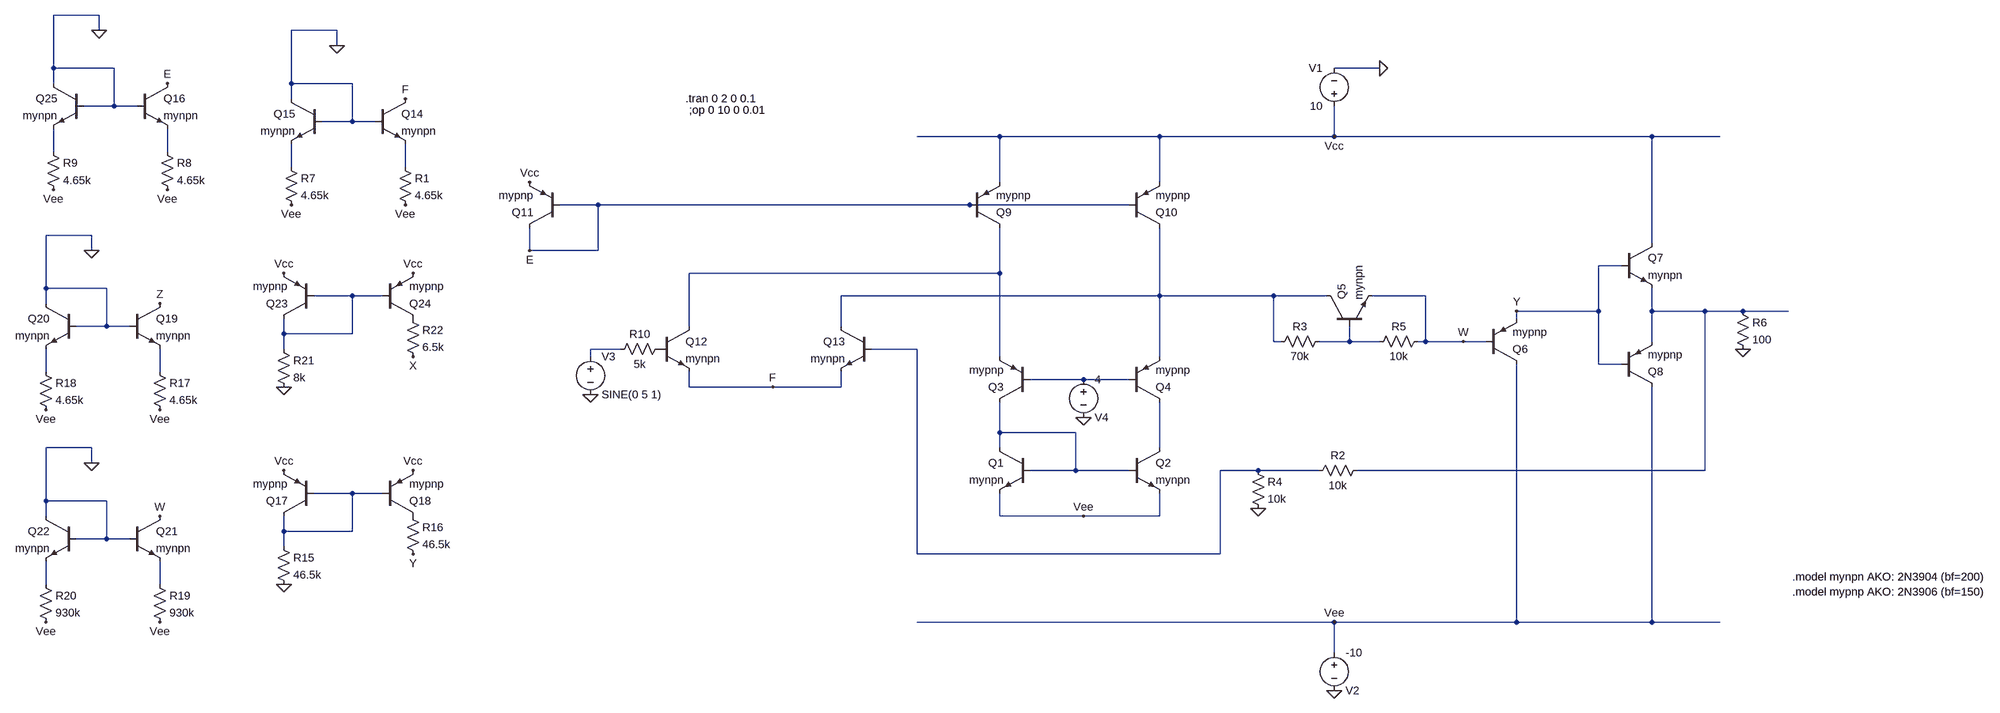
[diagram p0: schematic Draft1.asc]
Draft1.asc, the LTspice schematic file:
Version 4
SHEET 1 2324 680
WIRE -2576 -880 -2672 -880
WIRE -2576 -848 -2576 -880
WIRE -2000 -848 -2096 -848
WIRE -2000 -816 -2000 -848
WIRE -2672 -768 -2672 -880
WIRE -2544 -768 -2672 -768
WIRE 816 -768 720 -768
WIRE -2672 -736 -2672 -768
WIRE -2096 -736 -2096 -848
WIRE -1968 -736 -2096 -736
WIRE -2096 -704 -2096 -736
WIRE -2544 -688 -2544 -768
WIRE -2544 -688 -2608 -688
WIRE -2496 -688 -2544 -688
WIRE -1968 -656 -1968 -736
WIRE -1968 -656 -2032 -656
WIRE -1920 -656 -1968 -656
WIRE 16 -624 -160 -624
WIRE 352 -624 16 -624
WIRE 720 -624 720 -688
WIRE 720 -624 352 -624
WIRE 1392 -624 720 -624
WIRE 1536 -624 1392 -624
WIRE -2672 -592 -2672 -640
WIRE -2432 -592 -2432 -640
WIRE -2096 -560 -2096 -608
WIRE -1856 -560 -1856 -608
WIRE 16 -528 16 -624
WIRE 352 -528 352 -624
WIRE -832 -480 -912 -480
WIRE -48 -480 -832 -480
WIRE 288 -480 -48 -480
WIRE -2592 -416 -2688 -416
WIRE 1392 -400 1392 -624
WIRE -2592 -384 -2592 -416
WIRE -976 -384 -976 -432
WIRE -832 -384 -832 -480
WIRE -832 -384 -976 -384
WIRE 1328 -352 1280 -352
WIRE 16 -336 16 -432
WIRE 16 -336 -640 -336
WIRE -2688 -304 -2688 -416
WIRE -2560 -304 -2688 -304
WIRE -1968 -288 -2048 -288
WIRE -1904 -288 -1968 -288
WIRE 352 -288 352 -432
WIRE 352 -288 -320 -288
WIRE 592 -288 352 -288
WIRE 704 -288 592 -288
WIRE 912 -288 800 -288
WIRE -2688 -272 -2688 -304
WIRE 1280 -256 1280 -352
WIRE 1280 -256 1104 -256
WIRE 1392 -256 1392 -304
WIRE 1504 -256 1392 -256
WIRE 1584 -256 1504 -256
WIRE 1680 -256 1584 -256
WIRE 1104 -240 1104 -256
WIRE -2560 -224 -2560 -304
WIRE -2560 -224 -2624 -224
WIRE -2512 -224 -2560 -224
WIRE -640 -224 -640 -336
WIRE -320 -224 -320 -288
WIRE -2112 -208 -2112 -240
WIRE -1968 -208 -1968 -288
WIRE -1968 -208 -2112 -208
WIRE 592 -192 592 -288
WIRE 608 -192 592 -192
WIRE 752 -192 752 -224
WIRE 752 -192 688 -192
WIRE 816 -192 752 -192
WIRE 912 -192 912 -288
WIRE 912 -192 896 -192
WIRE 992 -192 912 -192
WIRE 1040 -192 992 -192
WIRE 1392 -192 1392 -256
WIRE -2112 -176 -2112 -208
WIRE -784 -176 -848 -176
WIRE -160 -176 -256 -176
WIRE -848 -160 -848 -176
WIRE 16 -160 16 -336
WIRE 352 -160 352 -288
WIRE 1280 -144 1280 -256
WIRE 1328 -144 1280 -144
WIRE -2688 -128 -2688 -176
WIRE -2448 -128 -2448 -176
WIRE 192 -112 80 -112
WIRE 288 -112 192 -112
WIRE -640 -96 -640 -128
WIRE -464 -96 -640 -96
WIRE -320 -96 -320 -128
WIRE -320 -96 -464 -96
WIRE 16 0 16 -64
WIRE 176 0 16 0
WIRE -2592 32 -2688 32
WIRE 16 32 16 0
WIRE 352 32 352 -64
WIRE -2592 64 -2592 32
WIRE 176 80 176 0
WIRE 176 80 80 80
WIRE 288 80 176 80
WIRE 560 80 480 80
WIRE 688 80 560 80
WIRE 1504 80 1504 -256
WIRE 1504 80 768 80
WIRE -1968 128 -2048 128
WIRE -1904 128 -1968 128
WIRE -2688 144 -2688 32
WIRE -2560 144 -2688 144
WIRE -2688 176 -2688 144
WIRE 16 176 16 128
WIRE 192 176 16 176
WIRE 352 176 352 128
WIRE 352 176 192 176
WIRE -2112 208 -2112 176
WIRE -1968 208 -1968 128
WIRE -1968 208 -2112 208
WIRE -2560 224 -2560 144
WIRE -2560 224 -2624 224
WIRE -2512 224 -2560 224
WIRE -2112 240 -2112 208
WIRE -160 256 -160 -176
WIRE 480 256 480 80
WIRE 480 256 -160 256
WIRE -2688 320 -2688 272
WIRE -2448 320 -2448 272
WIRE 720 400 -160 400
WIRE 1104 400 1104 -144
WIRE 1104 400 720 400
WIRE 1392 400 1392 -96
WIRE 1392 400 1104 400
WIRE 1536 400 1392 400
WIRE 720 464 720 400
FLAG 1584 -176 0
FLAG 560 160 0
FLAG 720 544 0
FLAG 816 -768 0
FLAG 720 -624 Vcc
FLAG 720 400 Vee
FLAG 1104 -256 Y
FLAG 992 -192 W
FLAG -1840 80 Vcc
FLAG -2112 80 Vcc
FLAG -2112 320 0
FLAG -1840 256 Y
FLAG -2592 -384 0
FLAG -2688 -48 Vee
FLAG -2448 -272 Z
FLAG -2448 -48 Vee
FLAG -2592 64 0
FLAG -2688 400 Vee
FLAG -2448 400 Vee
FLAG -2448 176 W
FLAG -1840 -336 Vcc
FLAG -2112 -336 Vcc
FLAG -2112 -96 0
FLAG -1840 -160 X
FLAG 192 -32 0
FLAG -976 -528 Vcc
FLAG 192 176 Vee
FLAG -2000 -816 0
FLAG -2096 -480 Vee
FLAG -1856 -480 Vee
FLAG -1856 -704 F
FLAG -464 -96 F
FLAG -2576 -848 0
FLAG -2672 -512 Vee
FLAG -2432 -512 Vee
FLAG -2432 -736 E
FLAG -976 -384 E
FLAG -848 -80 0
SYMBOL npn 80 32 M0
SYMATTR InstName Q1
SYMATTR Value mynpn
SYMBOL npn 288 32 R0
SYMATTR InstName Q2
SYMATTR Value mynpn
SYMBOL npn 704 -224 R270
SYMATTR InstName Q5
SYMATTR Value mynpn
SYMBOL npn 1328 -400 R0
SYMATTR InstName Q7
SYMATTR Value mynpn
SYMBOL pnp 1040 -144 M180
SYMATTR InstName Q6
SYMATTR Value mypnp
SYMBOL pnp 1328 -96 M180
SYMATTR InstName Q8
SYMATTR Value mypnp
SYMBOL voltage 720 -672 R180
WINDOW 0 24 96 Left 2
WINDOW 3 24 16 Left 2
WINDOW 123 0 0 Left 0
WINDOW 39 0 0 Left 0
SYMATTR InstName V1
SYMATTR Value 10
SYMBOL voltage 720 448 R0
WINDOW 0 24 96 Left 2
WINDOW 3 24 16 Left 2
WINDOW 123 0 0 Left 0
WINDOW 39 0 0 Left 0
SYMATTR InstName V2
SYMATTR Value -10
SYMBOL res 784 64 R90
WINDOW 0 0 56 VBottom 2
WINDOW 3 32 56 VTop 2
SYMATTR InstName R2
SYMATTR Value 10k
SYMBOL res 704 -208 R90
WINDOW 0 0 56 VBottom 2
WINDOW 3 32 56 VTop 2
SYMATTR InstName R3
SYMATTR Value 70k
SYMBOL res 544 64 R0
SYMATTR InstName R4
SYMATTR Value 10k
SYMBOL res 912 -208 R90
WINDOW 0 0 56 VBottom 2
WINDOW 3 32 56 VTop 2
SYMATTR InstName R5
SYMATTR Value 10k
SYMBOL res 1568 -272 R0
SYMATTR InstName R6
SYMATTR Value 100
SYMBOL voltage 192 -128 R0
WINDOW 0 24 96 Left 2
WINDOW 3 24 16 Left 2
WINDOW 123 0 0 Left 0
WINDOW 39 0 0 Left 0
SYMATTR InstName V4
SYMATTR Value 4
SYMBOL pnp -2048 176 R180
SYMATTR InstName Q17
SYMATTR Value mypnp
SYMBOL pnp -1904 176 M180
SYMATTR InstName Q18
SYMATTR Value mypnp
SYMBOL res -2128 224 R0
SYMATTR InstName R15
SYMATTR Value 46.5k
SYMBOL res -1856 160 R0
SYMATTR InstName R16
SYMATTR Value 46.5k
SYMBOL npn -2512 -272 R0
SYMATTR InstName Q19
SYMATTR Value mynpn
SYMBOL npn -2624 -272 M0
SYMATTR InstName Q20
SYMATTR Value mynpn
SYMBOL res -2464 -144 R0
SYMATTR InstName R17
SYMATTR Value 4.65k
SYMBOL res -2704 -144 R0
SYMATTR InstName R18
SYMATTR Value 4.65k
SYMBOL npn -2512 176 R0
SYMATTR InstName Q21
SYMATTR Value mynpn
SYMBOL npn -2624 176 M0
SYMATTR InstName Q22
SYMATTR Value mynpn
SYMBOL res -2464 304 R0
SYMATTR InstName R19
SYMATTR Value 930k
SYMBOL res -2704 304 R0
SYMATTR InstName R20
SYMATTR Value 930k
SYMBOL pnp -2048 -240 R180
SYMATTR InstName Q23
SYMATTR Value mypnp
SYMBOL pnp -1904 -240 M180
SYMATTR InstName Q24
SYMATTR Value mypnp
SYMBOL res -2128 -192 R0
SYMATTR InstName R21
SYMATTR Value 8k
SYMBOL res -1856 -256 R0
SYMATTR InstName R22
SYMATTR Value 6.5k
SYMBOL pnp 80 -64 R180
SYMATTR InstName Q3
SYMATTR Value mypnp
SYMBOL pnp 288 -64 M180
SYMATTR InstName Q4
SYMATTR Value mypnp
SYMBOL pnp -48 -432 M180
SYMATTR InstName Q9
SYMATTR Value mypnp
SYMBOL pnp 288 -432 M180
SYMATTR InstName Q10
SYMATTR Value mypnp
SYMBOL npn -704 -224 R0
SYMATTR InstName Q12
SYMATTR Value mynpn
SYMBOL npn -256 -224 M0
SYMATTR InstName Q13
SYMATTR Value mynpn
SYMBOL pnp -912 -432 R180
SYMATTR InstName Q11
SYMATTR Value mypnp
SYMBOL npn -1920 -704 R0
SYMATTR InstName Q14
SYMATTR Value mynpn
SYMBOL npn -2032 -704 M0
SYMATTR InstName Q15
SYMATTR Value mynpn
SYMBOL res -1872 -576 R0
SYMATTR InstName R1
SYMATTR Value 4.65k
SYMBOL res -2112 -576 R0
SYMATTR InstName R7
SYMATTR Value 4.65k
SYMBOL npn -2496 -736 R0
SYMATTR InstName Q16
SYMATTR Value mynpn
SYMBOL npn -2608 -736 M0
SYMATTR InstName Q25
SYMATTR Value mynpn
SYMBOL res -2448 -608 R0
SYMATTR InstName R8
SYMATTR Value 4.65k
SYMBOL res -2688 -608 R0
SYMATTR InstName R9
SYMATTR Value 4.65k
SYMBOL res -688 -192 R90
WINDOW 0 0 56 VBottom 2
WINDOW 3 32 56 VTop 2
SYMATTR InstName R10
SYMATTR Value 5k
SYMBOL voltage -848 -176 R0
WINDOW 123 0 0 Left 0
WINDOW 39 0 0 Left 0
SYMATTR InstName V3
SYMATTR Value SINE(0 5 1)
TEXT 1688 304 Left 2 !.model mynpn AKO: 2N3904 (bf=200)
TEXT 1688 336 Left 2 !.model mypnp AKO: 2N3906 (bf=150)
TEXT -648 -704 Left 2 !.tran 0 2 0 0.1
TEXT -640 -680 Left 2 !;op 0 10 0 0.01

The netlist it stands for:
* Draft1.asc
Q1 N015 N015 Vee 0 mynpn
Q2 N016 N015 Vee 0 mynpn
Q5 N007 N009 W 0 mynpn
Q7 Vcc Y N008 0 mynpn
Q6 Vee W Y 0 mypnp
Q8 Vee Y N008 0 mypnp
V1 Vcc 0 10
V2 Vee 0 -10
R2 N008 N011 10k
R3 N009 N007 70k
R4 N011 0 10k
R5 W N009 10k
R6 N008 0 100
V4 N014 0 4
Q17 N017 N017 Vcc 0 mypnp
Q18 P001 N017 Vcc 0 mypnp
R15 N017 0 46.5k
R16 P001 Y 46.5k
Q19 Z 0 N013 0 mynpn
Q20 0 0 N012 0 mynpn
R17 N013 Vee 4.65k
R18 N012 Vee 4.65k
Q21 W 0 N019 0 mynpn
Q22 0 0 N018 0 mynpn
R19 N019 Vee 930k
R20 N018 Vee 930k
Q23 N006 N006 Vcc 0 mypnp
Q24 P002 N006 Vcc 0 mypnp
R21 N006 0 8k
R22 P002 X 6.5k
Q3 N015 N014 N005 0 mypnp
Q4 N016 N014 N007 0 mypnp
Q9 N005 E Vcc 0 mypnp
Q10 N007 E Vcc 0 mypnp
Q12 N005 P003 F 0 mynpn
Q13 N007 N011 F 0 mynpn
Q11 E E Vcc 0 mypnp
Q14 F 0 N004 0 mynpn
Q15 0 0 N003 0 mynpn
R1 N004 Vee 4.65k
R7 N003 Vee 4.65k
Q16 E 0 N002 0 mynpn
Q25 0 0 N001 0 mynpn
R8 N002 Vee 4.65k
R9 N001 Vee 4.65k
R10 P003 N010 5k
V3 N010 0 SINE(0 5 1)
.model NPN NPN
.model PNP PNP
.lib standard.bjt
.model mynpn AKO: 2N3904 (bf=200)
.model mypnp AKO: 2N3906 (bf=150)
.tran 0 2 0 0.1
;op 0 10 0 0.01
.backanno
.end